# Altium project Sanity0.PrjPcb
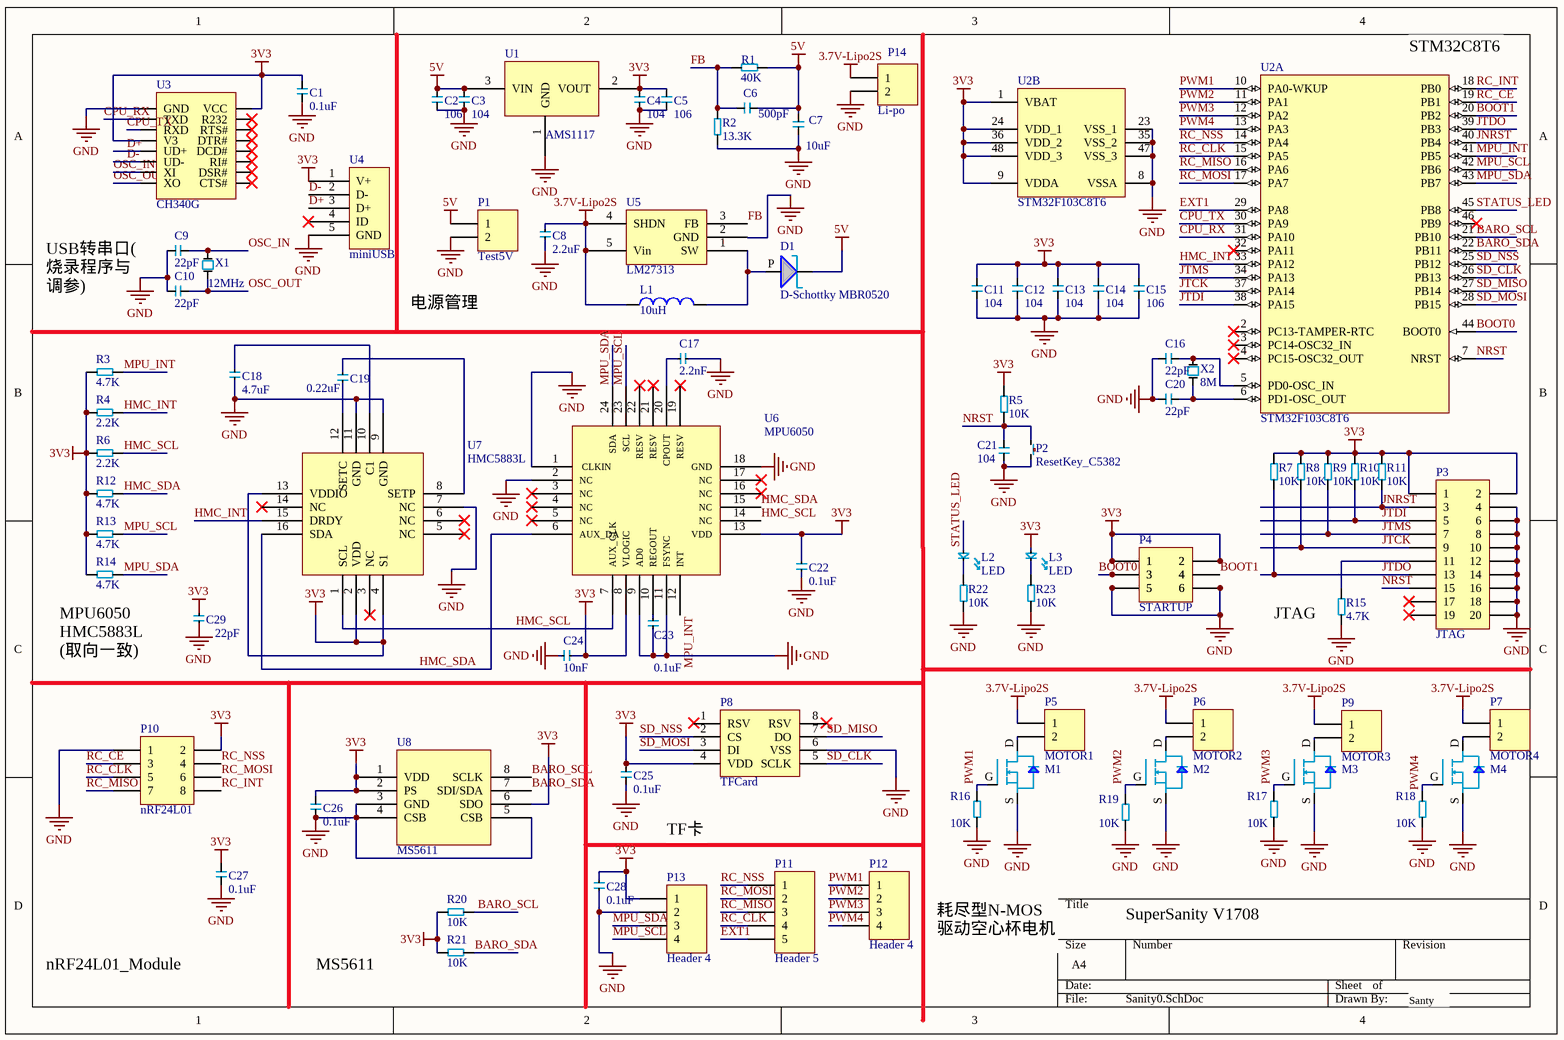
[diagram p0: Sanity0.SchDoc]
1 sheet, 84 parts. Net scope: global (net labels, ports and power ports of the same name join across sheets).
Board file: Sanity0.PcbDoc

## Sheet Sanity0.SchDoc: SuperSanity V170731
size A4

### Parts
C1  0.1uF  [LC-0402]
C2  106  [LC-0402]
C3  104  [LC-0402]
C4  104  [LC-0402]
C5  106  [LC-0402]
C6  500pF  [LC-0402]
C7  10uF  [LC-0402]
C8  2.2uF  [Cap-0603]
C9  22pF  [LC-0402]
C10  22pF  [LC-0402]
C11  104  [LC-0402]
C12  104  [LC-0402]
C13  104  [LC-0402]
C14  104  [LC-0402]
C15  106  [LC-0402]
C16  22pF  [LC-0402]
C17  2.2nF  [Cap-0603]
C18  4.7uF  [Cap-0603]
C19  0.22uF  [Cap-0603]
C20  22pF  [LC-0402]
C21  104  [LC-0402]
C22  0.1uF  [Cap-0603]
C23  0.1uF  [Cap-0603]
C24  10nF  [Cap-0603]
C25  0.1uF  [LC-0402]
C26  0.1uF  [LC-0402]
C27  0.1uF  [LC-0402]
C28  0.1uF  [Cap-0603]
C29  22pF  [Cap-0603]
D1  D-Schottky MBR0520  [SOD123]
L1  value 10uH  [INDC1608L]  (hidden comment: Inductor)
L2  LED  [0603_LED_S1]
L3  LED  [0603_LED_S1]
M1  SI2302-NMOS  [SOT-23(SOT-23-3)]  (value not drawn)
M2  SI2302-NMOS  [SOT-23(SOT-23-3)]  (value not drawn)
M3  SI2302-NMOS  [SOT-23(SOT-23-3)]  (value not drawn)
M4  SI2302-NMOS  [SOT-23(SOT-23-3)]  (value not drawn)
P1  Test5V  [HDR1X2]
P2  ResetKey_C5382  [ResetKeyC5382]
P3  JTAG  [HDR2X10]
P4  STARTUP  [HDR2X3]
P5  MOTOR1  [HDR1X2]
P6  MOTOR2  [HDR1X2]
P7  MOTOR4  [HDR1X2]
P8  TFCard  [TF_card]
P9  MOTOR3  [HDR1X2]
P10  nRF24L01  [HDR2X4]
P11  Header 5  [HDR1X5]
P12  Header 4  [HDR1X4]
P13  Header 4  [HDR1X4]
P14  Li-po  [HDR1X2]
R1  40K  [Res-0402]
R2  13.3K  [Res-0402]
R3  4.7K  [Res-0402]
R4  2.2K  [Res-0402]
R5  10K  [Res-0402]
R6  2.2K  [Res-0402]
R7  10K  [Res-0402]
R8  10K  [Res-0402]
R9  10K  [Res-0402]
R10  10K  [Res-0402]
R11  10K  [Res-0402]
R12  4.7K  [Res-0402]
R13  4.7K  [Res-0402]
R14  4.7K  [Res-0402]
R15  4.7K  [Res-0402]
R16  10K  [Res-0402]
R17  10K  [Res-0402]
R18  10K  [Res-0402]
R19  10K  [Res-0402]
R20  10K  [Res-0402]
R21  10K  [Res-0402]
R22  10K  [Res-0402]
R23  10K  [Res-0402]
U1  AMS1117  [AMS1117]
U2  STM32F103C8T6  [STM-LQFP48_N]  (parts A,B of 2)
U3  CH340G  [LC-SOP-16_150mil]
U4  miniUSB  [miniUSB]
U5  LM27313  [LM27313]
U6  MPU6050  [MPU6050]
U7  HMC5883L  [LCCS50P300X300X90-16N-1]
U8  MS5611  [MS5611]
X1  12MHz  [LC-HC-49SMD]
X2  8M  [LC-HC-49SMD]

### Nets
3.7V-Lipo2S: C8.1 L1.1 P5.1 P6.1 P7.1 P9.1 P14.1 U5.4(SHDN) U5.5(Vin)
3V3: C1.1 C4.1 C5.1 C11.0 C12.1 C13.1 C14.1 C15.1 C22.1 C24.1 C25.1 C26.1 C27.1 C28.1 C29.1 L3.P P3.1 P3.2 P4.1 P4.2 P8.4(VDD) P10.2 P13.1 R3.0 R4.0 R5.0 R6.0 R7.0 R8.0 R9.0 R10.0 R11.0 R12.0 R13.0 R14.0 R20.0 R21.0 U1.2(VOUT) U2.1(VBAT) U2.9(VDDA) U2.24(VDD_1) U2.36(VDD_2) U2.48(VDD_3) U3.4(V3) U3.16(VCC) U4.1(V+) U6.8(VLOGIC) U6.13(VDD) U7.2(VDD) U7.4(S1) U7.13(VDDIO) U8.1(VDD) U8.2(PS) U8.6(SDO)
5V: C2.1 C3.1 C6.1 C7.1 D1.N P1.1 R1.0 U1.3(VIN)
GND: C1.0 C2.0 C3.0 C4.0 C5.0 C7.0 C8.2 C9.1 C10.1 C11.1 C12.0 C13.0 C14.0 C15.0 C16.0 C17.1 C18.2 C20.0 C21.0 C22.2 C23.2 C24.2 C25.0 C26.0 C27.0 C28.2 C29.2 M1.S M2.S M3.S M4.S P1.2 P2.0 P3.4 P3.6 P3.8 P3.10 P3.12 P3.14 P3.16 P3.18 P3.20 P4.5 P4.6 P8.6(VSS) P10.1 P13.2 P14.2 R2.1 R15.1 R16.1 R17.1 R18.0 R19.0 R22.1 R23.1 U1.1(GND) U2.8(VSSA) U2.23(VSS_1) U2.35(VSS_2) U2.47(VSS_3) U3.1(GND) U4.5(GND) U5.2(GND) U6.1(CLKIN) U6.2(NC) U6.9(AD0) U6.11(FSYNC) U6.18(GND) U7.7(NC) U7.9(GND) U7.11(GND) U8.3(GND) U8.4(CSB) U8.5(CSB)
BARO_SCL: R20.1 U2.21(PB10) U8.8(SCLK)
BARO_SDA: R21.1 U2.22(PB11) U8.7(SDI/SDA)
BOOT0: P4.3 U2.44(BOOT0)
BOOT1: P4.4 U2.20(PB2)
CPU_RX: U2.31(PA10) U3.2(TXD)
CPU_TX: U2.30(PA9) U3.3(RXD)
D+: U3.5(UD+) U4.3(D+)
D-: U3.6(UD-) U4.2(D-)
EXT1: P11.5 U2.29(PA8)
FB: C6.0 R1.1 R2.0 U5.3(FB)
HMC_INT: R4.1 U2.33(PA12) U7.15(DRDY)
HMC_SCL: R6.1 U6.7(AUX_CLK) U6.14(NC) U7.1(SCL)
HMC_SDA: R12.1 U6.6(AUX_DA) U6.15(NC) U7.16(SDA)
JNRST: P3.3 R11.1 U2.40(PB4)
JTCK: P3.9 R8.1 U2.37(PA14)
JTDI: P3.5 R10.1 U2.38(PA15)
JTDO: P3.13 R7.1 U2.39(PB3)
JTMS: P3.7 R9.1 U2.34(PA13)
MPU_INT: R3.1 U2.41(PB5) U6.12(INT)
MPU_SCL: P13.4 R13.1 U2.42(PB6) U6.23(SCL)
MPU_SDA: P13.3 R14.1 U2.43(PB7) U6.24(SDA)
NRST: C21.1 P2.1 P3.15 R5.1 U2.7(NRST)
OSC_IN: C9.0 U3.7(XI) X1.0
OSC_OUT: C10.0 U3.8(XO) X1.1
PWM1: M1.G P12.1 R16.0 U2.10(PA0-WKUP)
PWM2: M2.G P12.2 R19.1 U2.11(PA1)
PWM3: M3.G P12.3 R17.0 U2.12(PA2)
PWM4: M4.G P12.4 R18.1 U2.13(PA3)
RC_CE: P10.3 U2.19(PB1)
RC_CLK: P10.5 P11.4 U2.15(PA5)
RC_INT: P10.8 U2.18(PB0)
RC_MISO: P10.7 P11.3 U2.16(PA6)
RC_MOSI: P10.6 P11.2 U2.17(PA7)
RC_NSS: P10.4 P11.1 U2.14(PA4)
SD_CLK: P8.5(SCLK) U2.26(PB13)
SD_MISO: P8.7(DO) U2.27(PB14)
SD_MOSI: P8.3(DI) U2.28(PB15)
SD_NSS: P8.2(CS) U2.25(PB12)
STATUS_LED: L2.P U2.45(PB8)
NetC16_1: C16.1 U2.5(PD0-OSC_IN) X2.0
NetC17_2: C17.2 U6.20(CPOUT)
NetC18_1: C18.1 U7.10(C1)
NetC19_1: C19.1 U7.8(SETP)
NetC19_2: C19.2 U7.12(SETC)
NetC20_1: C20.1 U2.6(PD1-OSC_OUT) X2.1
NetC23_1: C23.1 U6.10(REGOUT)
NetD1_P: D1.P L1.2 U5.1(SW)
NetL2_N: L2.N R22.0
NetL3_N: L3.N R23.0
NetM1_D: M1.D P5.2
NetM2_D: M2.D P6.2
NetM3_D: M3.D P9.2
NetM4_D: M4.D P7.2
NetP3_11: P3.11 R15.0

Not connected (* = marked no-connect by the designer): P3 17* 19*; P8 1(RSV) 8(RSV); U2 2(PC13-TAMPER-RTC)* 3(PC14-OSC32_IN)* 4(PC15-OSC32_OUT)* 32(PA11)* 46(PB9)*; U3 9(CTS#)* 10(DSR#)* 11(RI#)* 12(DCD#)* 13(DTR#)* 14(RTS#)* 15(R232)*; U4 4(ID)*; U6 3(NC)* 4(NC)* 5(NC)* 16(NC)* 17(NC)* 19(RESV)* 21(RESV)* 22(RESV)*; U7 3(NC)* 5(NC)* 6(NC)* 14(NC)*

### Notes on the sheet
- (near U2) STM32C8T6
- USB转串口(烧录程序与调参)
- 电源管理
- (near R15) JTAG
- (near R14) MPU6050
  HMC5883L
  (取向一致)
- TF卡
- SuperSanity V1708
- nRF24L01_Module
- MS5611
- 耗尽型N-MOS驱动空心杯电机
- Santy

### Library data of the parts
C1-C7 C9-C16 C20 C21 C25-C27 = Cap-0402
C8 C17-C19 C22-C24 C28 C29 = Cap0603
L1 = Inductor: Code_IEC: 1005; Published: 8-Jun-2000; LatestRevisionDate: 29-May-2009; LatestRevisionNote: IPC-7351 Footprint Added.; PackageReference: 0402-A; Publisher: Altium Limited; PackageDescription: Chip Inductor; Code_JEITA: 0402
P1 P5-P7 P9 P14 = Header 2: Header, 2-Pin; LatestRevisionDate: 17-Jul-2002; LatestRevisionNote: Re-released for DXP Platform.; Publisher: Altium Limited
P3 = Header 10X2: Header, 10-Pin, Dual row; LatestRevisionDate: 17-Jul-2002; LatestRevisionNote: Re-released for DXP Platform.; Publisher: Altium Limited
P4 = Header 3X2: Header, 3-Pin, Dual row; LatestRevisionDate: 17-Jul-2002; LatestRevisionNote: Re-released for DXP Platform.; Publisher: Altium Limited
P10 = Header 4X2: Header, 4-Pin, Dual row; LatestRevisionDate: 17-Jul-2002; LatestRevisionNote: Re-released for DXP Platform.; Publisher: Altium Limited
P11 = Header 5: Header, 5-Pin; LatestRevisionDate: 17-Jul-2002; LatestRevisionNote: Re-released for DXP Platform.; Publisher: Altium Limited
P12 P13 = Header 4: Header, 4-Pin; LatestRevisionDate: 17-Jul-2002; LatestRevisionNote: Re-released for DXP Platform.; Publisher: Altium Limited
R1-R23 = Res-0402
U2 = STM32F103C8T6: ARM Cortex-M3 32-bit MCU, 64 KB Flash, 20 KB Internal RAM, 37 I/Os, 48-pin LQFP, -40 to 85 degC, Tray; A/D Converter: 2x12-bit (10 Channel); FLASH Size (Prog) (kB): 64; I/Os (High Current): 37; Internal RAM Size (kB): 20; Operating Frequency(F) (Processor speed) (MHz): 72; Supply Voltage(Vcc) min (V): 2; DatasheetVersion: Rev. 16; PackageVersion: Rev. 6, 06/2013; PackageReference: LQFP48; PackageDescription: 48-Pin Low Profile Quad Flat Package, 7 x 7 mm Body, 0.5 mm Pitch; Supplier 1: Digi-Key; Supplier Part Number 1: 497-6063-ND; Supplier 2: Farnell; Supplier Part Number 2: 1447637; Supplier 3: Newark; Supplier Part Number 3: 59M2182; Supplier 4: Newark; Supplier Part Number 4: 57P1222; Supplier 5: Mouser; Supplier Part Number 5: 511-STM32F103C8T6; Core: ARM Cortex-M3; Packing: Tray; Mounting Technology: Surface Mount; PartNumber: STM32F103C8T6; ComponentLink1Description: Manufacturer URL; ComponentLink1URL: http://www.st.com/web/en/home.html; ComponentLink2Description: Datasheet; ComponentLink2URL: http://www.st.com/st-web-ui/static/active/en/resource/technical/document/datasheet/CD00161566.pdf; ComponentLink3Description: Package Specification; ComponentLink3URL: http://www.st.com/st-web-ui/static/active/en/resource/technical/document/datasheet/DM00058181.pdf
X1 X2 = 49SMD